# EAGLE schematic bc-module-pir (EAGLE 7.7.0)
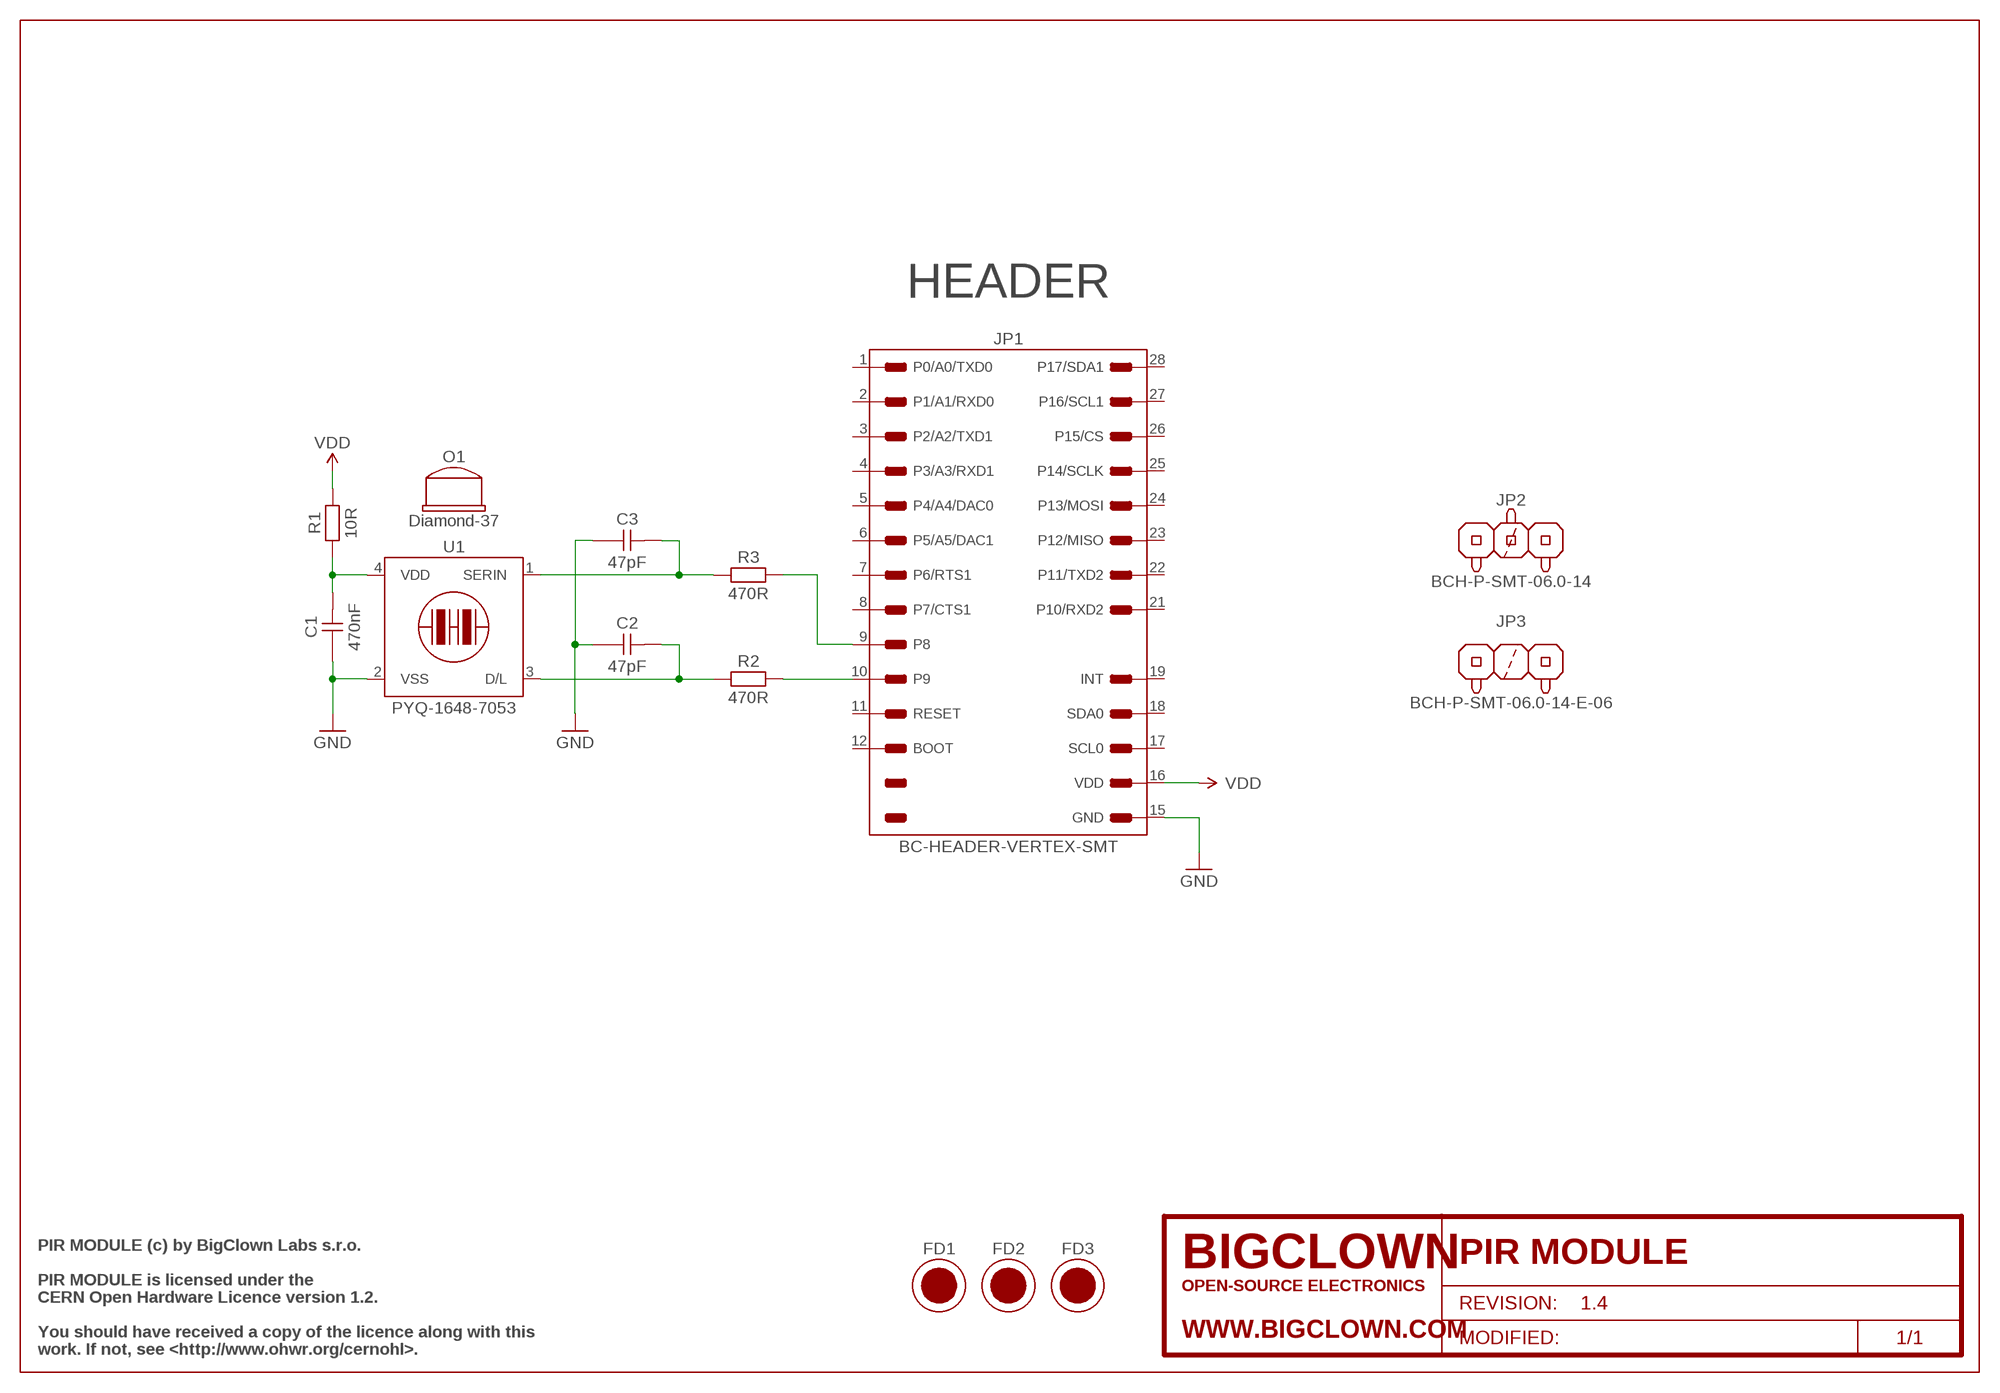
[diagram p0: schematic, sheet 1]

## Parts
C1  470nF  C-0805-470NF  [CAPACITOR-0805_R]
C2  47pF  C-0805-47PF  [CAPACITOR-0805_R]
C3  47pF  C-0805-47PF  [CAPACITOR-0805_R]
FD1  FIDUCIAL  [FIDUCIAL-1MM]
FD2  FIDUCIAL  [FIDUCIAL-1MM]
FD3  FIDUCIAL  [FIDUCIAL-1MM]
FRAME1  FRAME-SCH/A4L-BRD/A4L  [FRAME-A4L]
JP1  BC-HEADER-VERTEX-SMT  [BC-HEADER-VERTEX-SMT]
JP2  BCH-P-SMT-06.0-14  JP-BCH-P-SMT-06.0-14  [BCH-P-SMT-14]
JP3  BCH-P-SMT-06.0-14-E-06  JP-BCH-P-SMT-06.0-14-E-06  [BCH-P-SMT-14-E-06]
O1  Diamond-37  O-DIAMOND-37  [DIAMOND-37]
R1  10R  R-0805-10R  [RESISTOR-0805_R]
R2  470R  R-0805-470R  [RESISTOR-0805_R]
R3  470R  R-0805-470R  [RESISTOR-0805_R]
U1  PYQ-1648-7053  U-PYQ1648-7053  [PYQ1648-7053_T]

## Nets
D/L: C2.1 R2.1 U1.3(D/L)
GND: C1.2 C2.2 C3.2 JP1.15(GND) U1.2(VSS)
P8: JP1.9(P8) R3.2
P9: JP1.10(P9) R2.2
SERIN: C3.1 R3.1 U1.1(SERIN)
VDD: JP1.16(VDD) R1.2
VDD_SENSOR: C1.1 R1.1 U1.4(VDD)
Unconnected: JP1.1(P0/A0/TXD0) JP1.2(P1/A1/RXD0) JP1.3(P2/A2/TXD1) JP1.4(P3/A3/RXD1) JP1.5(P4/A4/DAC0) JP1.6(P5/A5/DAC1) JP1.7(P6/RTS1) JP1.8(P7/CTS1) JP1.11(RESET) JP1.12(BOOT) JP1.17(SCL0) JP1.18(SDA0) JP1.19(INT) JP1.21(P10/RXD2) JP1.22(P11/TXD2) JP1.23(P12/MISO) JP1.24(P13/MOSI) JP1.25(P14/SCLK) JP1.26(P15/CS) JP1.27(P16/SCL1) JP1.28(P17/SDA1)

## Notes on the sheet
- HEADER
- PIR MODULE (c) by BigClown Labs s.r.o.
- PIR MODULE is licensed under the
- CERN Open Hardware Licence version 1.2.
- You should have received a copy of the licence along with this
- work. If not, see <http://www.ohwr.org/cernohl>.

## Library data of the parts
C1 = bc-capacitor:C-0805-470NF; BCPN: BC-C-0805-470NF
C2 C3 = bc-capacitor:C-0805-47PF; BCPN: BC-C-0805-47PF
FD1-FD3 = bc-fiducial:FIDUCIAL; BCPN: -
FRAME1 = bc-frame:FRAME-SCH/A4L-BRD/A4L; BCPN: -; PROJECT_NAME: PIR MODULE; PROJECT_REVISION: 1.4
JP1 = bc-header:BC-HEADER-VERTEX-SMT; BCPN: -
JP2 = bc-header:JP-BCH-P-SMT-06.0-14; BCPN: BC-JP-BCH-P-SMT-06.0-14
JP3 = bc-header:JP-BCH-P-SMT-06.0-14-E-06; BCPN: BC-JP-BCH-P-SMT-06.0-14-E-06
O1 = bc-mechanical:O-DIAMOND-37; BCPN: BC-O-Diamond-37
R1 = bc-resistor:R-0805-10R; BCPN: BC-R-0805-10R
R2 R3 = bc-resistor:R-0805-470R; BCPN: BC-R-0805-470R
U1 = bc-sensor:U-PYQ1648-7053; BCPN: BC-U-PYQ-1648-7053